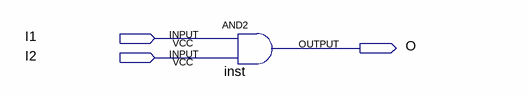
[diagram p0: schematic sheet]
// Quartus schematic Exam_Kostin.bdf as structural Verilog: 1 symbols, 3 pins
module Exam_Kostin (
  input  I1,
  input  I2,
  output O
);

  and inst (O, I1, I2);
endmodule
